# Altium schematic sheet FILR.SchDoc
size A2
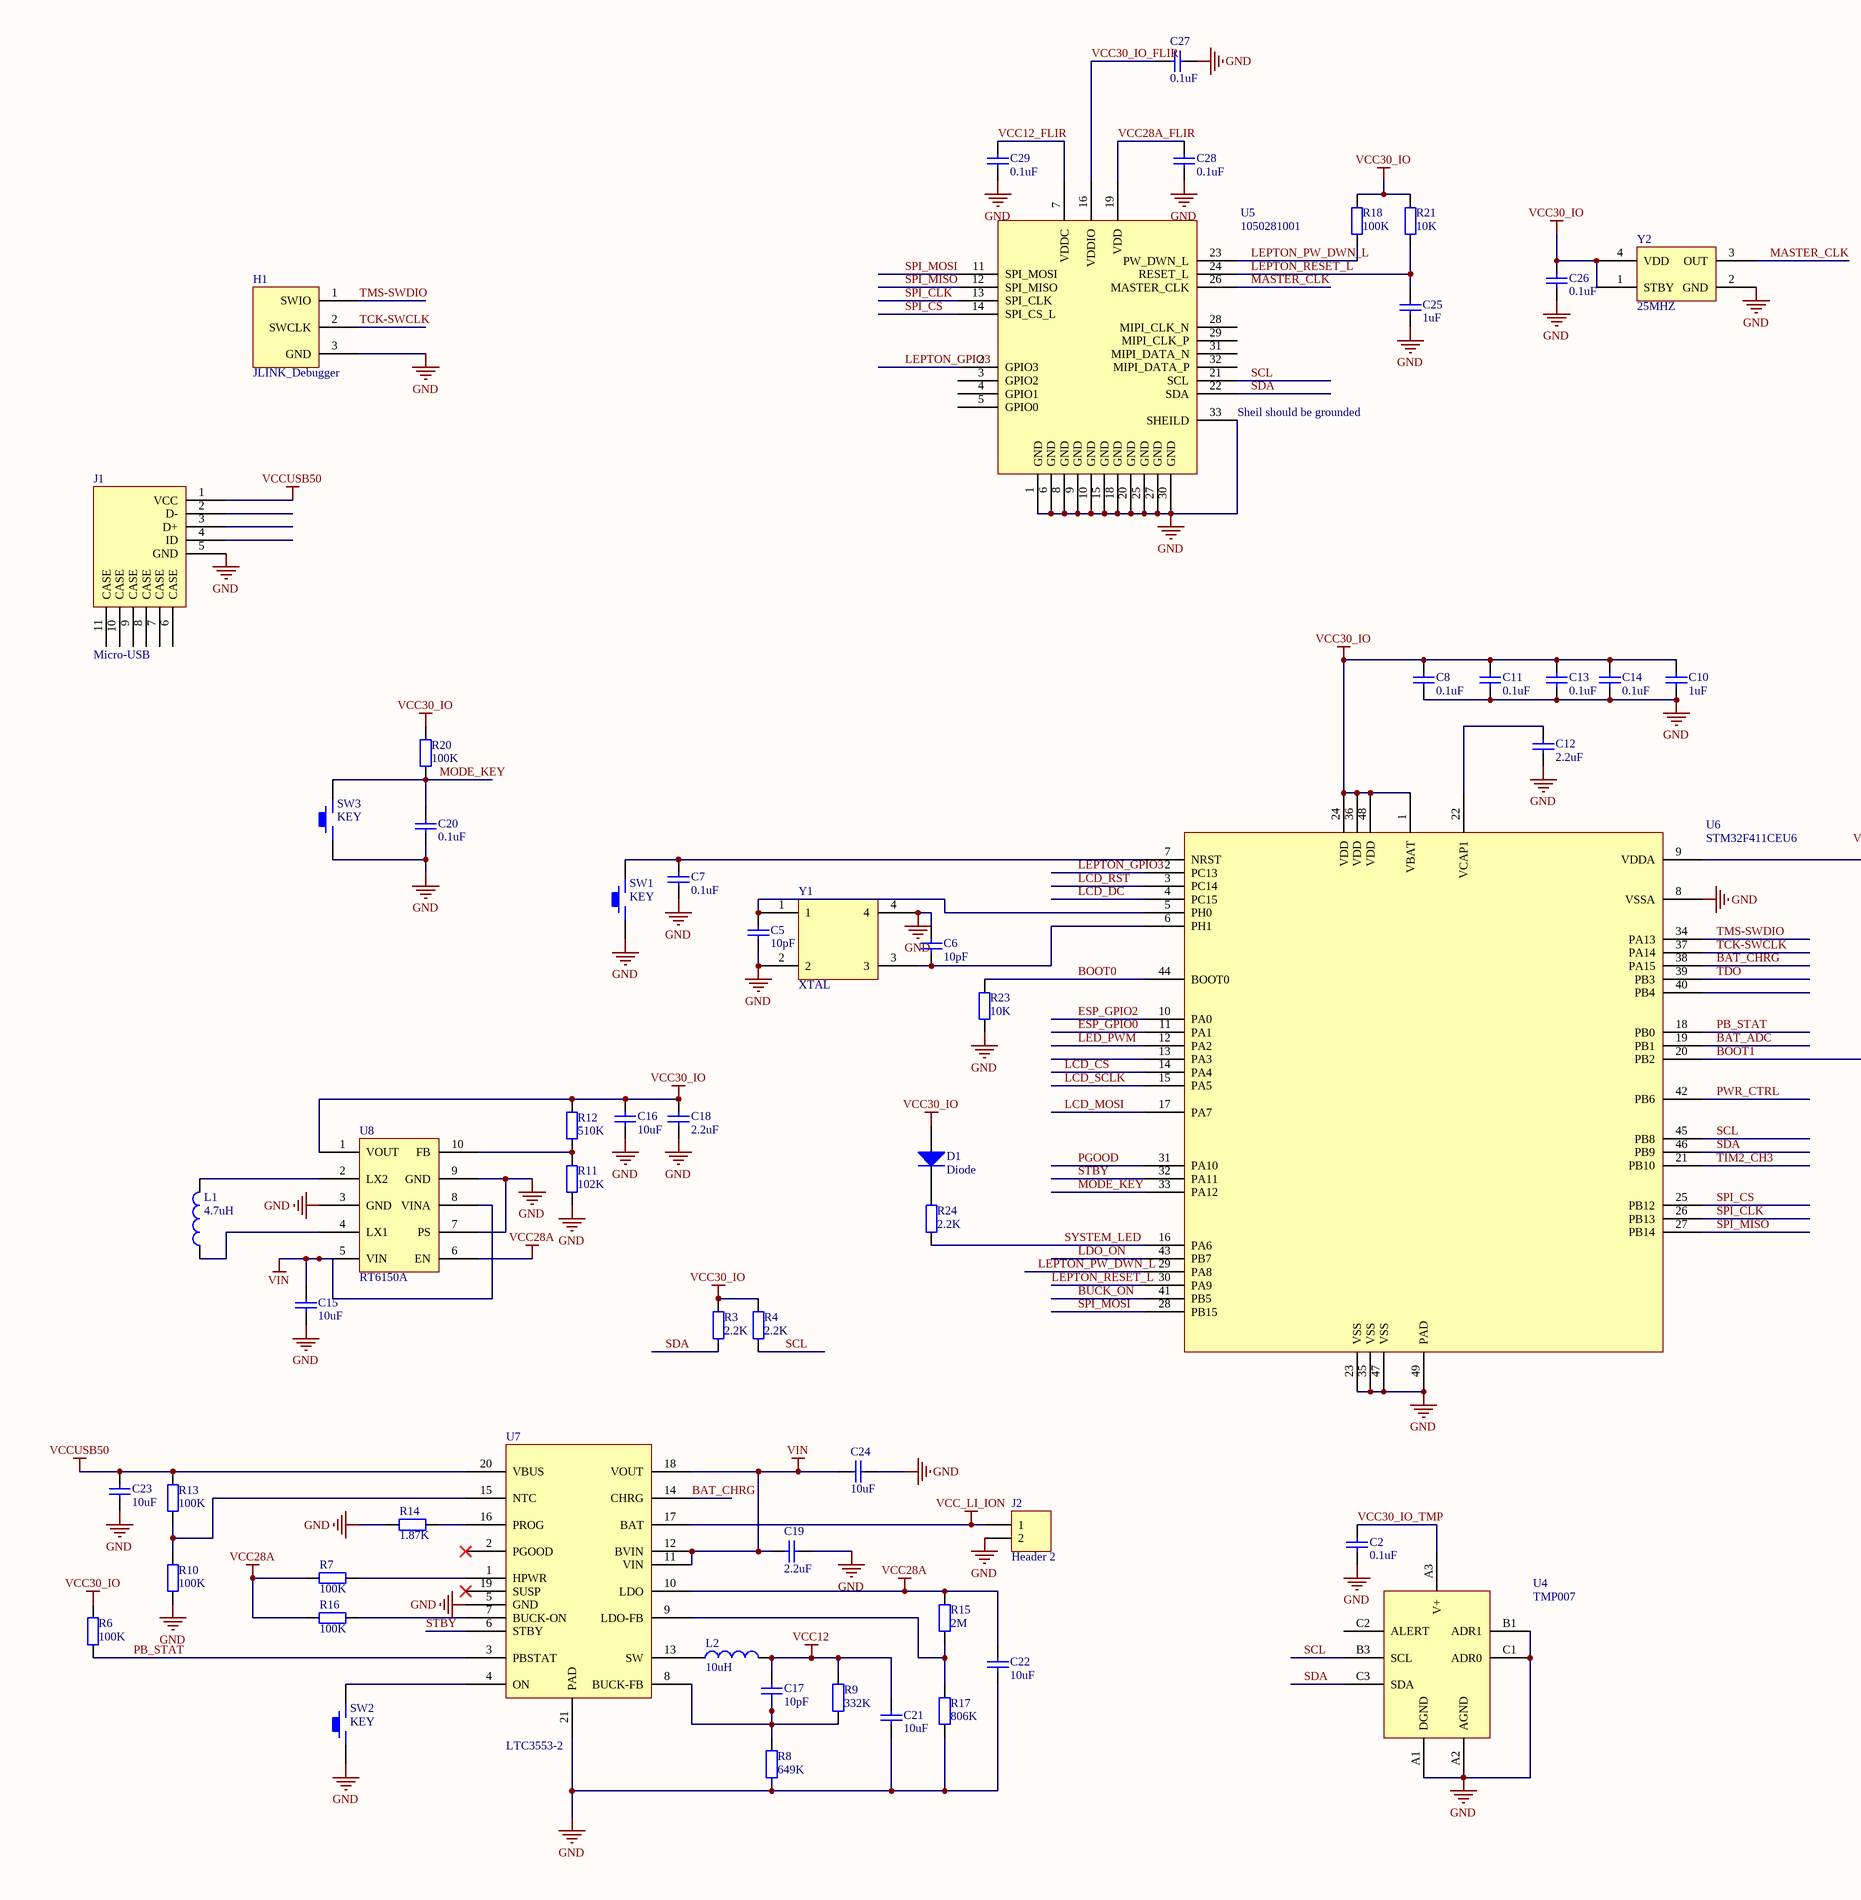
[diagram p0: FILR.SchDoc, left]
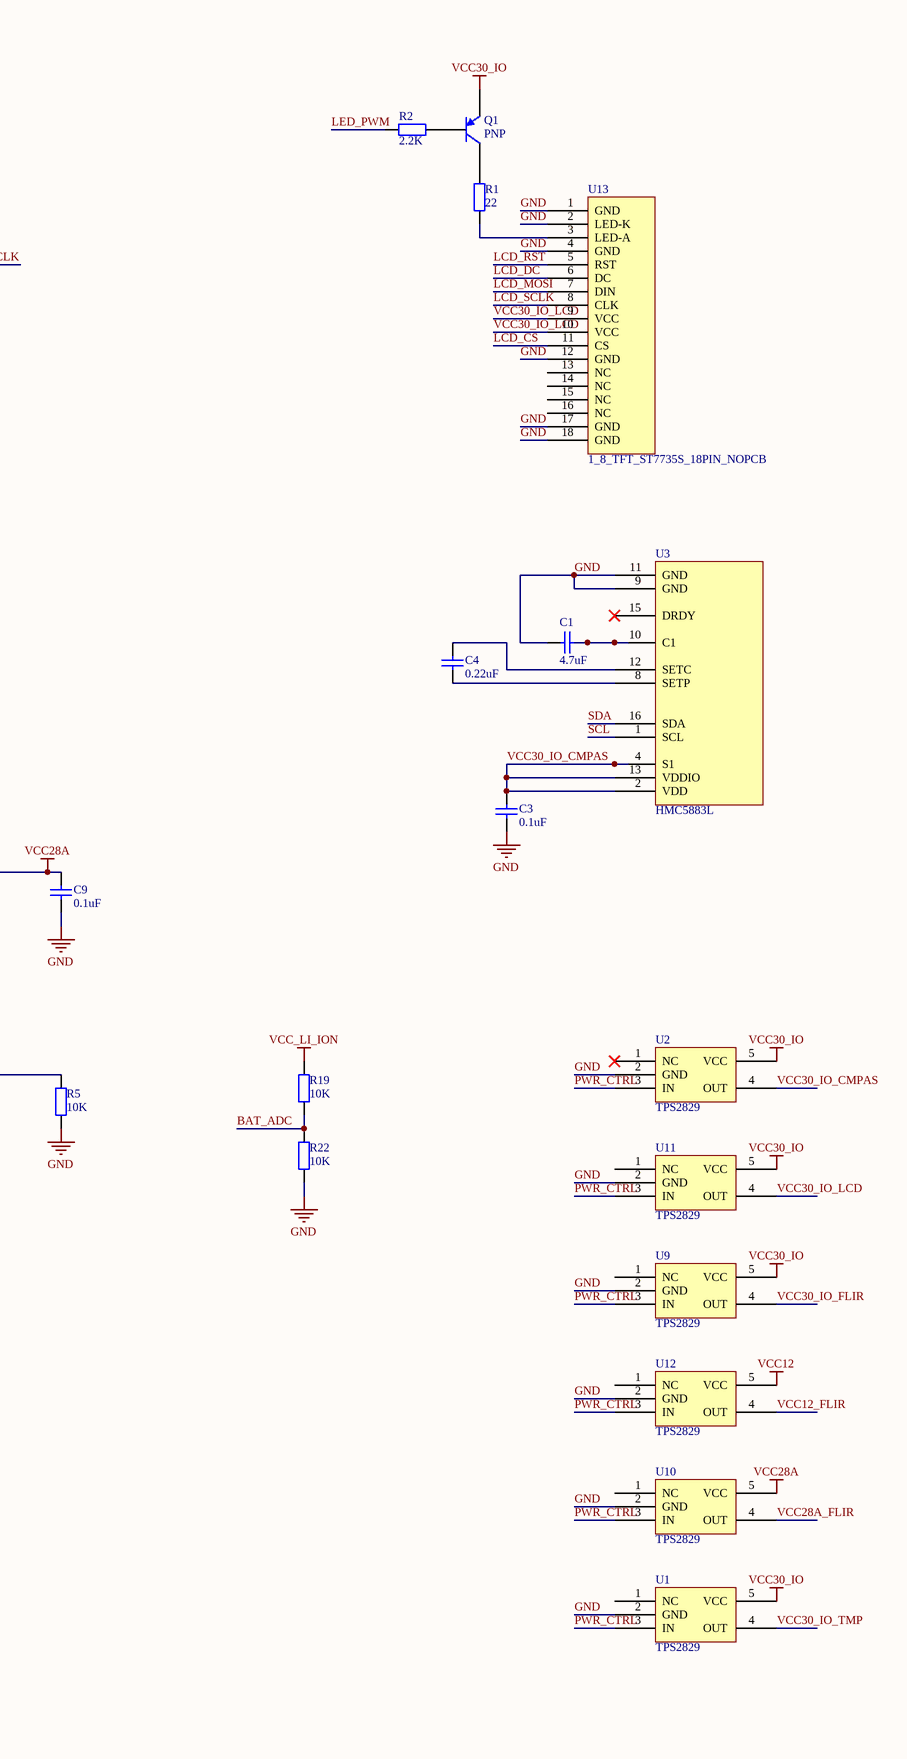
[diagram p1: FILR.SchDoc, right]

## Parts
C1  4.7uF  [CAP_0603_SMD]
C2  0.1uF  [CAP_0402_SMD]
C3  0.1uF  [CAP_0402_SMD]
C4  0.22uF  [CAP_0603_SMD]
C5  10pF  [CAP_0603_SMD]
C6  10pF  [CAP_0603_SMD]
C7  0.1uF  [CAP_0402_SMD]
C8  0.1uF  [CAP_0402_SMD]
C9  0.1uF  [CAP_0402_SMD]
C10  1uF  [CAP_0603_SMD]
C11  0.1uF  [CAP_0402_SMD]
C12  2.2uF  [CAP_0603_SMD]
C13  0.1uF  [CAP_0402_SMD]
C14  0.1uF  [CAP_0402_SMD]
C15  10uF  [CAP-SMD-0805]
C16  10uF  [CAP-SMD-0805]
C17  10pF  [CAP_0603_SMD]
C18  2.2uF  [CAP_0603_SMD]
C19  2.2uF  [CAP_0603_SMD]
C20  0.1uF  [CAP_0402_SMD]
C21  10uF  [CAP-SMD-0805]
C22  10uF  [CAP-SMD-0805]
C23  10uF  [CAP-SMD-0805]
C24  10uF  [CAP-SMD-0805]
C25  1uF  [CAP_0603_SMD]
C26  0.1uF  [CAP_0402_SMD]
C27  0.1uF  [CAP_0402_SMD]
C28  0.1uF  [CAP_0402_SMD]
C29  0.1uF  [CAP_0402_SMD]
D1  Diode  [DIO_0402_SMD]
H1  JLINK_Debugger  [HDR1X3]
J1  Micro-USB  [Micro-USB]
J2  Header 2  [HDR_1X2]
L1  4.7uH  [INDC_2520_SMD]
L2  10uH  [INDC_2520_SMD]
Q1  PNP  [SOT-23B_N]
R1  22  [RES_0603_SMD]
R2  2.2K  [RES_0603_SMD]
R3  2.2K  [RES_0603_SMD]
R4  2.2K  [RES_0603_SMD]
R5  10K  [RES_0402_SMD]
R6  100K  [RES_0603_SMD]
R7  100K  [RES_0603_SMD]
R8  649K  [RES_0603_SMD]
R9  332K  [RES_0603_SMD]
R10  100K  [RES_0603_SMD]
R11  102K  [RES_0603_SMD]
R12  510K  [RES_0603_SMD]
R13  100K  [RES_0603_SMD]
R14  1.87K  [CAP-SMD-0805]
R15  2M  [RES_0603_SMD]
R16  100K  [RES_0603_SMD]
R17  806K  [RES_0603_SMD]
R18  100K  [RES_0603_SMD]
R19  10K  [RES_0603_SMD]
R20  100K  [RES_0603_SMD]
R21  10K  [RES_0402_SMD]
R22  10K  [RES_0603_SMD]
R23  10K  [RES_0402_SMD]
R24  2.2K  [RES_0603_SMD]
SW1  KEY  [SW-B3U-3000P]
SW2  KEY  [SW-B3U-3000P]
SW3  KEY  [SW-B3U-3000P]
U1  TPS2829  [SOT23-5]
U2  TPS2829  [SOT23-5]
U3  HMC5883L  [HMC2883_QFN_16]
U4  TMP007  [DSBGA_8PIN]
U5  1050281001  [FLIR_Camera_Socket]
U6  STM32F411CEU6  [QFPN_48]
U7  LTC3553-2  [QFN_20]
U8  RT6150A  [RT6150A_SON_10PIN_3X3]
U9  TPS2829  [SOT23-5]
U10  TPS2829  [SOT23-5]
U11  TPS2829  [SOT23-5]
U12  TPS2829  [SOT23-5]
U13  1_8_TFT_ST7735S_18PIN_NOPCB  [1_8_TFT_18PIN_NO_PCB]
Y1  XTAL  [14.31818_MHZ]
Y2  25MHZ  [25MHZ_ASEMB]

## Nets
GND: C1.2 C2.1 C3.2 C5.1 C6.2 C7.1 C8.2 C9.1 C10.1 C11.1 C12.1 C13.1 C14.1 C15.1 C16.1 C18.1 C19.2 C20.1 C21.1 C22.1 C23.2 C24.2 C25.1 C26.1 C27.2 C28.1 C29.1 H1.3(GND) J1.5(GND) J2.2 R5.1 R8.2 R10.2 R11.1 R14.2 R17.2 R22.1 R23.1 SW1.1 SW2.1 SW3.1 U1.2(GND) U2.2(GND) U3.9(GND) U3.11(GND) U4.A1(DGND) U4.A2(AGND) U4.B1(ADR1) U4.C1(ADR0) U5.1(GND) U5.6(GND) U5.8(GND) U5.9(GND) U5.10(GND) U5.15(GND) U5.18(GND) U5.20(GND) U5.25(GND) U5.27(GND) U5.30(GND) U5.33(SHEILD) U5.34 U5.35 U5.36 U5.37 U5.38 U5.39 U5.40 U5.41 U5.42 U5.43 U5.44 U5.45 U5.46 U5.47 U5.48 U5.49 U5.50 U5.51 U5.52 U5.53 U5.54 U5.55 U5.56 U5.57 U5.58 U5.59 U5.60 U5.61 U5.62 U5.63 U5.64 U5.65 U5.66 U5.67 U5.68 U6.8(VSSA) U6.23(VSS) U6.35(VSS) U6.47(VSS) U6.49(PAD) U7.5(GND) U7.21(PAD) U8.3(GND) U8.7(PS) U8.9(GND) U8.11 U9.2(GND) U10.2(GND) U11.2(GND) U12.2(GND) U13.1(GND) U13.2(LED-K) U13.4(GND) U13.12(GND) U13.17(GND) U13.18(GND) Y1.2 Y1.4 Y2.2(GND)
VCC12: C17.2 C21.2 L2.2 R9.1 U12.5(VCC)
VCC28A: C9.2 C22.2 R7.1 R15.1 R16.1 U6.9(VDDA) U7.10(LDO) U8.6(EN) U10.5(VCC)
VCC30_IO: C8.1 C10.2 C11.2 C13.2 C14.2 C16.2 C18.2 C26.2 D1.1(A) Q1.3(E) R3.2 R4.2 R6.1 R12.2 R18.2 R20.1 R21.2 U1.5(VCC) U2.5(VCC) U6.1(VBAT) U6.24(VDD) U6.36(VDD) U6.48(VDD) U8.1(VOUT) U9.5(VCC) U11.5(VCC) Y2.1(STBY) Y2.4(VDD)
VCC_LI_ION: J2.1 R19.2 U7.17(BAT)
VCCUSB50: C23.1 J1.1(VCC) R13.1 U7.20(VBUS)
VIN: C15.2 C19.1 C24.1 U7.11(VIN) U7.12(BVIN) U7.18(VOUT) U8.5(VIN) U8.8(VINA)
BAT_ADC: R19.1 R22.2 U6.19(PB1)
BAT_CHRG: U6.38(PA15) U7.14(CHRG)
BOOT0: R23.2 U6.44(BOOT0)
BOOT1: R5.2 U6.20(PB2)
BUCK_ON: U6.41(PB5)
ESP_GPIO0: U6.11(PA1)
ESP_GPIO2: U6.10(PA0)
LCD_CS: U6.14(PA4) U13.11(CS)
LCD_DC: U6.4(PC15) U13.6(DC)
LCD_MOSI: U6.17(PA7) U13.7(DIN)
LCD_RST: U6.3(PC14) U13.5(RST)
LCD_SCLK: U6.15(PA5) U13.8(CLK)
LDO_ON: U6.43(PB7)
LED_PWM: R2.2 U6.12(PA2)
LEPTON_GPIO3: U5.2(GPIO3) U6.2(PC13)
LEPTON_PW_DWN_L: R18.1 U5.23(PW_DWN_L) U6.29(PA8)
LEPTON_RESET_L: C25.2 R21.1 U5.24(RESET_L) U6.30(PA9)
MASTER_CLK: U5.26(MASTER_CLK) Y2.3(OUT)
MODE_KEY: C20.2 R20.2 SW3.2 U6.33(PA12)
PB_STAT: R6.2 U6.18(PB0) U7.3(PBSTAT)
PGOOD: U6.31(PA10)
PWR_CTRL: U1.3(IN) U2.3(IN) U6.42(PB6) U9.3(IN) U10.3(IN) U11.3(IN) U12.3(IN)
SCL: R4.1 U3.1(SCL) U4.B3(SCL) U5.21(SCL) U6.45(PB8)
SDA: R3.1 U3.16(SDA) U4.C3(SDA) U5.22(SDA) U6.46(PB9)
SPI_CLK: U5.13(SPI_CLK) U6.26(PB13)
SPI_CS: U5.14(SPI_CS_L) U6.25(PB12)
SPI_MISO: U5.12(SPI_MISO) U6.27(PB14)
SPI_MOSI: U5.11(SPI_MOSI) U6.28(PB15)
STBY: U6.32(PA11) U7.6(STBY)
SYSTEM_LED: R24.1 U6.16(PA6)
TCK-SWCLK: H1.2(SWCLK) U6.37(PA14)
TDO: U6.39(PB3)
TIM2_CH3: U6.21(PB10)
TMS-SWDIO: H1.1(SWIO) U6.34(PA13)
VCC12_FLIR: C29.2 U5.7(VDDC) U12.4(OUT)
VCC28A_FLIR: C28.2 U5.19(VDD) U10.4(OUT)
VCC30_IO_CMPAS: C3.1 U2.4(OUT) U3.2(VDD) U3.4(S1) U3.13(VDDIO)
VCC30_IO_FLIR: C27.1 U5.16(VDDIO) U9.4(OUT)
VCC30_IO_LCD: U11.4(OUT) U13.9(VCC) U13.10(VCC)
VCC30_IO_TMP: C2.2 U1.4(OUT) U4.A3(V+)
NetC1_1: C1.1 U3.10(C1)
NetC4_1: C4.1 U3.12(SETC)
NetC4_2: C4.2 U3.8(SETP)
NetC5_2: C5.2 U6.5(PH0) Y1.1
NetC6_1: C6.1 U6.6(PH1) Y1.3
NetC7_2: C7.2 SW1.2 U6.7(NRST)
NetC12_2: C12.2 U6.22(VCAP1)
NetC17_1: C17.1 R8.1 R9.2 U7.8(BUCK-FB)
NetD1_2: D1.2(K) R24.2
NetL1_1: L1.1 U8.4(LX1)
NetL1_2: L1.2 U8.2(LX2)
NetL2_1: L2.1 U7.13(SW)
NetQ1_1: Q1.1(C) R1.2
NetQ1_2: Q1.2(B) R2.1
NetR1_1: R1.1 U13.3(LED-A)
NetR7_2: R7.2 U7.1(HPWR)
NetR10_1: R10.1 R13.2 U7.15(NTC)
NetR11_2: R11.2 R12.1 U8.10(FB)
NetR14_1: R14.1 U7.16(PROG)
NetR15_2: R15.2 R17.1 U7.9(LDO-FB)
NetR16_2: R16.2 U7.7(BUCK-ON)
NetSW2_2: SW2.2 U7.4(ON)

Not connected (* = marked no-connect by the designer): J1 2(D-) 3(D+) 4(ID) 6(CASE) 7(CASE) 8(CASE) 9(CASE) 10(CASE) 11(CASE); U1 1(NC); U2 1(NC)*; U3 3(NC) 5(NC) 6(NC) 7(NC) 14(NC) 15(DRDY)*; U4 C2(ALERT); U5 3(GPIO2) 4(GPIO1) 5(GPIO0) 28(MIPI_CLK_N) 29(MIPI_CLK_P) 31(MIPI_DATA_N) 32(MIPI_DATA_P); U6 13(PA3) 40(PB4); U7 2(PGOOD)* 19(SUSP)*; U9 1(NC); U10 1(NC); U11 1(NC); U12 1(NC); U13 13(NC) 14(NC) 15(NC) 16(NC)

## Notes on the sheet
- (in symbol 1050281001) Sheil should be grounded

## Library data of the parts
C1 = Cap: Capacitor; Manufacturer: KEMET; Class: Passive; P/N: C0603C475K9PACTU; Published: 08/06/2000; Publisher: Altium Hobart Technology Centre; SubClass: Capacitor; Value: 4.7uF
C2 C3 C7-C9 C11 C13 C14 C20 C26-C29 = Cap: Capacitor; Manufacturer: TDK; Class: Passive; P/N: CGA2B1X7R1C104K050BC; Published: 08/06/2000; Publisher: Altium Hobart Technology Centre; SubClass: Capacitor; Value: 0.1uF
C4 = Cap: Capacitor; Manufacturer: TDK; Class: Passive; P/N: C1608X7R1C224K080AC; Published: 08/06/2000; Publisher: Altium Hobart Technology Centre; SubClass: Capacitor; Value: 0.22uF
C5 C6 C17 = Cap: Capacitor; Manufacturer: KEMET; Class: Passive; P/N: C0603C100J5GACTU; Published: 08/06/2000; Publisher: Altium Hobart Technology Centre; SubClass: Capacitor; Value: 10pF
C10 C25 = Cap: Capacitor; Manufacturer: YAGEO; Class: Passive; P/N: CC0603ZRY5V7BB105; Published: 08/06/2000; Publisher: Altium Hobart Technology Centre; SubClass: Capacitor; Value: 1uF
C12 C18 C19 = Cap: Capacitor; Manufacturer: YAGEO; Class: Passive; P/N: CC0603KRX5R6BB225; Published: 08/06/2000; Publisher: Altium Hobart Technology Centre; SubClass: Capacitor; Value: 2.2uF
C15 C16 C21 C22 = Cap: Capacitor; Manufacturer: YAGEO; Class: Passive; P/N: CC0805KKX5R5BB106; Published: 08/06/2000; Publisher: Altium Hobart Technology Centre; SubClass: Capacitor; Value: 10uF
C23 C24 = Cap: Capacitor; Manufacturer: YAGEO; Class: Passive; P/N: CC0805KKX5R6BB106; Published: 08/06/2000; Publisher: Altium Hobart Technology Centre; SubClass: Capacitor; Value: 10uF
D1 = Diode: Manufacturer: Generic Components; Class: Discrete; SubClass: Diode - Switching; Published: 08/06/2000; Publisher: Altium Hobart Technology Centre
J1 = Micro-USB: Manufacturer: 10104111-0001LF; Class: AMPHENOL; Value: Micro-USB
J2 = Header 2: Header, 2-Pin; LatestRevisionDate: 17-Jul-2002; LatestRevisionNote: Re-released for DXP Platform.; Publisher: Altium Limited; Value: Header 2
L1 = Inductor: Manufacturer: SAMSUNG; Class: Passive; P/N: CIG22B4R7MNE; Published: 08/06/2000; Publisher: Altium Hobart Technology Centre; SubClass: Inductor; Value: 4.7uH
L2 = Inductor: Manufacturer: SAMSUNG; Class: Passive; P/N: CIG22L100MNE; Published: 08/06/2000; Publisher: Altium Hobart Technology Centre; SubClass: Inductor; Value: 10uH
Q1 = PNP: PNP Bipolar Transistor; Published: 8-Jun-2000; LatestRevisionDate: 29-May-2009; LatestRevisionNote: IPC-7351 Footprint Added.; PackageVersion: Aug-1999; PackageReference: SOT-23B; Publisher: Altium Limited; PackageDescription: 3-Pin SOT-23 Package 0.95 mm Pitch, 2.4 mm Lead Span
R1 = Res2: Resistor; Manufacturer: YAGEO; P/N: RC0603JR-0722RL; Published: 8-Jun-2000; LatestRevisionDate: 17-Jul-2002; LatestRevisionNote: Re-released for DXP Platform.; PackageReference: AXIAL-0.4; Publisher: Altium Limited; PackageDescription: Axial Device, Thru-Hole; 2 Leads; 0.4 in Pin Spacing; Value: 22; SubClass: Resistor
R2-R4 R24 = Res2: Resistor; Manufacturer: YAGEO; Class: Passive; P/N: RC0603FR-072K2L; Published: 08/06/2000; Publisher: Altium Hobart Technology Centre; SubClass: Resistor; Value: 2.2K
R5 R21 R23 = Res2: Resistor; Manufacturer: YAGEO; Class: Passive; P/N: RC0402FR-0710KL; Published: 08/06/2000; Publisher: Altium Hobart Technology Centre; SubClass: Resistor; Value: 10K
R6 R7 R13 R16 R18 R20 = Res2: Resistor; Manufacturer: YAGEO; Class: Passive; P/N: RC0603FR-07100KL; Published: 08/06/2000; Publisher: Altium Hobart Technology Centre; SubClass: Resistor; Value: 100K
R8 = Res2: Resistor; Manufacturer: YAGEO; Class: Passive; P/N: RC0603FR-07649KL; Published: 08/06/2000; Publisher: Altium Hobart Technology Centre; SubClass: Resistor; Value: 649K
R9 R15 = Res2: Resistor; Manufacturer: YAGEO; Class: Passive; P/N: RC0603FR-07332KL; Published: 08/06/2000; Publisher: Altium Hobart Technology Centre; SubClass: Resistor
  R9: Value: 332K
  R15: Value: 2M
R10 = Res2: Resistor; Manufacturer: VISHAY; Class: Passive; P/N: NTHS0603N01N1003F; Published: 08/06/2000; Publisher: Altium Hobart Technology Centre; SubClass: Resistor; Value: 100K
R11 = Res2: Resistor; Manufacturer: YAGEO; Class: Passive; P/N: RC0603FR-07102KL; Published: 08/06/2000; Publisher: Altium Hobart Technology Centre; SubClass: Resistor; Value: 102K
R12 = Res2: Resistor; Manufacturer: YAGEO; Class: Passive; P/N: RC0603FR-07510RL; Published: 08/06/2000; Publisher: Altium Hobart Technology Centre; SubClass: Resistor; Value: 510K
R14 = Res2: Resistor; Manufacturer: YAGEO; Class: Passive; P/N: RC0805FR-071K87L; Published: 08/06/2000; Publisher: Altium Hobart Technology Centre; SubClass: Resistor; Value: 1.87K
R17 = Res2: Resistor; Manufacturer: YAGEO; Class: Passive; P/N: RC0603FR-07806KL; Published: 08/06/2000; Publisher: Altium Hobart Technology Centre; SubClass: Resistor; Value: 806K
R19 R22 = Res2: Resistor; Manufacturer: YAGEO; Class: Passive; Value: 510K; P/N: RC0603FR-07510RL; Published: 08/06/2000; Publisher: Altium Hobart Technology Centre; SubClass: Resistor
SW1-SW3 = KEY: Manufacturer: OMRON ELECRONICS; P/N: B3U-3000P; Value: KEY
U1 U2 U9-U12 = TPS2829: Manufacturer: Texas-Instruments; P/N: TPS2829DBVR
U3 = HMC5883L: Manufacturer: Honeywell; P/N: HMC5883L-TR
U4 = TMP007: Manufacturer: TEXAS INSTRUMENTS; P/N: TMP007A1YZF; Value: TMP007
U5 = 1050281001: Manufacturer: Molex,-LLC; P/N: 1050281001
U6 = STM32F411CEU6: Manufacturer: STMicroelectronics; Value: STM32F411CEU6; P/N: STM32F411CEU6
U7 = LTC3553-2: Manufacturer: Linear Technology; P/N: LTC3553EUD-2#PBF
U8 = RT6150A: 3*3; Manufacturer: Richtek USA Inc.; P/N: RT6150AGQW
Y1 = XTAL: Manufacturer: ABRACON; Value: 14.31818MHZ , 20ppm, 18pf; P/N: ABM8-14.31818MHZ-B2-T
Y2 = 25MHZ: Manufacturer: ABRACON; P/N: ASEMB-25.000MHZ-LC; Value: 25MHZ